# Altium schematic sheet analog_input.SchDoc: Test
size Letter; SheetNumber: 1; SheetTotal: 3; Project: USB Oscope; ENG_APP_DATE: --/--/--; DSN_APP_DATE: --/--/--; CHK_APP_DATE: --/--/--
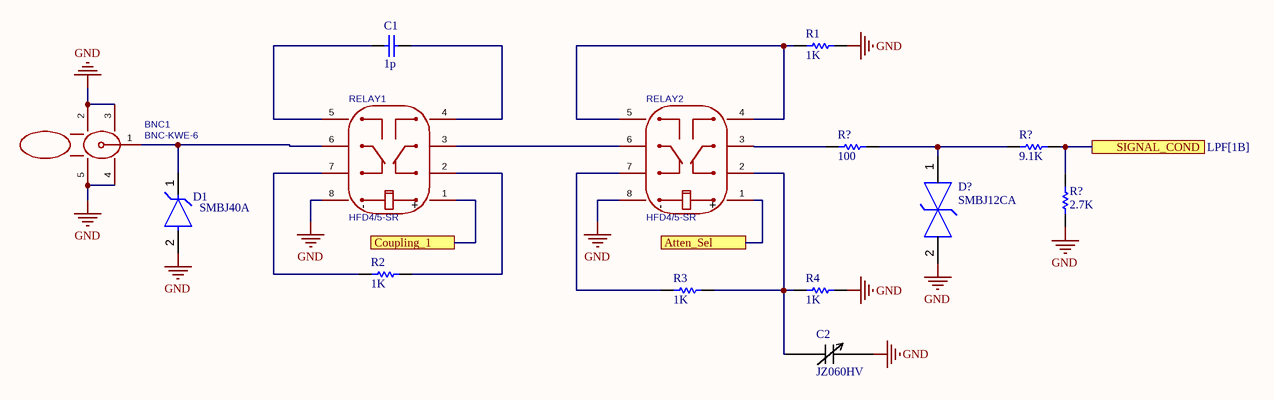
[diagram p0: analog_input.SchDoc]

## Parts
(Parts that share a designator on the sheet are numbered #1, #2 ... from top to bottom, then left to right.)
BNC1  BNC-KWE-6  [CONN-TH_BNC-KWE-6]
C1  value 1p  (hidden comment: Capacitor)
C2  JZ060HV  [CAPCP4914X60N]
D1  SMBJ40A  [FP-SMBJ-MFG]
D?  SMBJ12CA  [FP-SMBJ-MFG]
R1  value 1K  (hidden comment: Resistor)
R2  value 1K  (hidden comment: Resistor)
R3  value 1K  (hidden comment: Resistor)
R4  value 1K  (hidden comment: Resistor)
R?#1  value 100  (hidden comment: Resistor)
R?#2  value 9.1K  (hidden comment: Resistor)
R?#3  value 2.7K  (hidden comment: Resistor)
RELAY1  HFD4/5-SR  [RELAY-SMD_HFD4-5-SR]
RELAY2  HFD4/5-SR  [RELAY-SMD_HFD4-5-SR]

## Ports
Atten_Sel, Coupling_1, SIGNAL_COND (see LPF[1B])

## Nets
GND: BNC1.2 BNC1.3 BNC1.4 BNC1.5 C2.2 D1.2(A) D?.2 R1.1 R4.1 R?#3.2 RELAY1.8 RELAY2.8
Atten_Sel: RELAY2.1 ; port Atten_Sel
Coupling_1: RELAY1.1 ; port Coupling_1
SIGNAL_COND: R?#2.1 R?#3.1 ; port SIGNAL_COND
NetBNC1_1: BNC1.1 D1.1(C) RELAY1.6
NetC1_1: C1.1 RELAY1.5
NetC1_2: C1.2 RELAY1.4
NetC2_1: C2.1 R3.1 R4.2 RELAY2.2
NetD?_1: D?.1 R?#1.1 R?#2.2
NetR1_2: R1.2 RELAY2.4 RELAY2.5
NetR2_1: R2.1 RELAY1.7
NetR2_2: R2.2 RELAY1.2
NetR3_2: R3.2 RELAY2.7
NetR?#1_2: R?#1.2 RELAY2.3
NetRELAY1_3: RELAY1.3 RELAY2.6

## Notes on the sheet
- THIS DOCUMENT AND THE DATA DISCLOSED HEREIN OR
- HEREWITH IS THE PROPERTY OF ALTIUM LIMITED AND MAY
- DWG NO:
- REVISION
- REV:
- DESCRIPTION
- DATE
- APPROVED
- BE FREELY DISTRIBUTED IN WHOLE. NO RIGHTS ARE
- RESERVED OR EXPRESS OR IMPLIED WARANTEE GIVEN.
- ENG:
- APPROVALS
- PROJECT
- DSN:
- CHK:
- REFERENCE DOCUMENTS
- PROJECT REVISION:
- TITLE
- DOCUMENT REVISION:
- DESIGN ITEM:
- BOM:
- FAB DWG:
- PCB DWG:
- ASSY DWG:
- SCALE:
- A3
- SIZE
- CAGE CODE
- FILE NAME
- DWG NO.
- SHEET
- OF
- REV
- (in symbol CMP-006-000000-2) -; +

## Library data of the parts
BNC1 = CMP-004-000000-3: Connector Type:Board Side Interface:Inner Bore Number of Ports:1 Interface Length/Height:12mm Frequency:6GHz RF Series:BNC Impedance:50Ω Style:Bent tip; Manufacturer: cntitle(中戈泰斗); Number of Ports: 1; Value: 6GHz; 3D Model Transform: 531.016,1338.97378,0,0,0,0,0,-470.511,-149.606; Impedance: 50Ω; 3D Model: 1ee7285c1b8f4c589de2df097266f005聨0819f05c4eef4c71ace90d822a990e87; AddInBom: yes; RF Series: BNC; Interface Length/Height: 12mm; Source: P1.SCHLIB; Symbol: BNC-KWE-6; LCSC Part Name: 内孔 BNC 弯头; Style: Bent tip; Interface: Inner Bore; Manufacturer Part: BNC-KWE-6; Connector Type: Board Side; Supplier Part: C20415789; FootprintName: CONN-TH_BNC-KWE-6; Datasheet: https://item.szlcsc.com/datasheet/BNC-KWE-6/21743971.html; Device: BNC-KWE-6; ModelName: CONN-TH_BNC-KWE-6; Supplier Footprint: 弯插; ConvertToPcb: yes; JLCPCB Part Class: Extended Part; Design Item ID: BNC-KWE-6
C1 = Capacitor: SimulationGenericComponent: True
C2 = CMP-00011-8: Variable Capacitor, 350V, 2pF Min, 6pF Max, Vertical Adjuster, Surface Mount; Voltage Rating (DC): 125V; Case/Package: 1813; Max Operating Temperature: 85°C; Min Operating Temperature: -40°C; Mounting Technology: Surface Mount; Height: 1.45mm; Width: 3.2mm; RoHS: Compliant; REACH SVHC: Yes; Lifecycle Status: Production; Length: 4.5mm
D1 = CMP-08607-000120-1: TVS DIODE 40VWM 64.5VC DO214AA; Peak Pulse Power: 600W; Min Breakdown Voltage: 44.4V; Number of Unidirectional Channels: 1; Voltage Rating (DC): 40V; Max Reverse Leakage Current: 1uA; Peak Pulse Current: 9.3A; Element Configuration: Single; Direction: Unidirectional; Max Breakdown Voltage: 49.1V; Power Line Protection: No; Test Current: 1mA; Clamping Voltage-Max: 64.5V; Diode Type: ZENER; Max Power Dissipation: 5W; Reverse Breakdown Voltage: 44.4V; Packaging: Tape and Reel; Width: 3.94mm; Package Quantity: 3000; Resistor Type: Zener; Lead Free: Lead Free; Case/Package: DO-214AA; RoHS Compliant: Yes; Series: SMBJ; Max Surge Current: 9.3A; Termination: SMD/SMT; Number of Pins: 2; Length: 4.57mm; Max Operating Temperature: 150°C; Polarity: Unidirectional; Breakdown Voltage: 44.4V; Height: 2.237mm; Mount: Surface Mount; Power Dissipation: 600W; Number of Channels: 1; Operating Supply Voltage: 40V; Clamping Voltage: 64.5V; Number of Elements: 1; Min Operating Temperature: -55°C; Reverse Standoff Voltage: 40V; Leakage Current: 1uA
D? = CMP-08607-000016-1: TVS DIODE 12V 19.9V DO214AA; Manufacturer: Littelfuse Inc; Breakdown Voltage: 13.3V; Max Junction Temp: +150°C; Direction: Bidirectional; Number Of Channels: 1; Peak Pulse Current: 30.2A; Peak Pulse Power: 600W; ComponentLink2URL: https://www.littelfuse.com/~/media/electronics/datasheets/tvs_diodes/littelfuse_tvs_diode_smbj_datasheet.pdf.pdf; Category: Diode; Mouser Description: TVS Diodes - Transient Voltage Suppressors 12Vr 600W 30.2A 5% BiDirectional; Manufacturer Part Number: SMBJ12CA; Temperature: -65°C to +150°C; Device Class L2: TVS Diodes; Height: 2.61mm; Automotive: No; RoHS: TRUE; Digikey Description: TVS DIODE 12V 19.9V DO214AA; Device Class L3: unset; Temperature Range Low: -65°C; Octopart: https://octopart.com/smbj12ca-littelfuse-33212; Device Class L1: Circuit Protection; Package: SMBJ; Temperature Range High: +150°C; Reverse Standoff Voltage: 12V; Clamping Voltage: 19.9V; Lead Free: Yes; ComponentLink2Description: Datasheet
R1-R4 R?#1-R?#3 = Resistor: TC1: 0; SimulationGenericComponent: True; TC2: 0
RELAY1 RELAY2 = CMP-006-000000-2: Coil Voltage:5V Contact Form:2 Form C: 2C (DPDT-CO) Number of Pins:8 Contact Rating:1A@30VDC；300mA@125VAC Switching Voltage(Max):250V@AC；220V@DC Contact Material:AgNi + Gold plated Coil Rated Power:140mW Coil Resistance:178Ω Switching Current(Max):2A Oper; Manufacturer: HF(宏发); Release Time: 3ms; Coil Voltage: 5V; Coil Type: Polarized-Single Coil; AddInBom: yes; ModelName: RELAY-SMD_L10.0-W6.5-H5.7-LS7.5-P2.2; ModelTransform: 393.7,307.086,0,0,0,0,-0.005,0,0; ModelId: abc4320b17a04819849f22b1ebcd3fe7聨0819f05c4eef4c71ace90d822a990e87; Switching Current(Max): 2A; Coil Resistance: 178Ω; Coil Rated Power: 140mW; Contact Resistance: 100mΩ; ManufacturerPart: HFD4/5-SR; Contact Rating: 1A@30VDC；300mA@125VAC; Symbol: HFD4/5-S; JLCPCB Part Class: Extended Part; Operating Temperature: -40℃~+85℃; ConvertToPcb: yes; FootprintName: RELAY-SMD_HFD4-5-SR; Supplier Footprint: SMD,10x6.5mm; Device: HFD4/5-SR; Switching Voltage(Max): 250V@AC；220V@DC; SupplierPart: C64399; Contact Form: 2 Form C: 2C (DPDT-CO); Datasheet: https://item.szlcsc.com/datasheet/HFD4%252F5-SR/65466.html; Contact Material: AgNi + Gold plated; Design Item ID: HFD4/5-SR; Number of Pins: 8; LCSC Part Name: 超小型5V继电器 双刀双掷; Source: P1.SCHLIB; Operate Time: 3ms